# EAGLE schematic V-00880-00 (EAGLE 7.2.0)
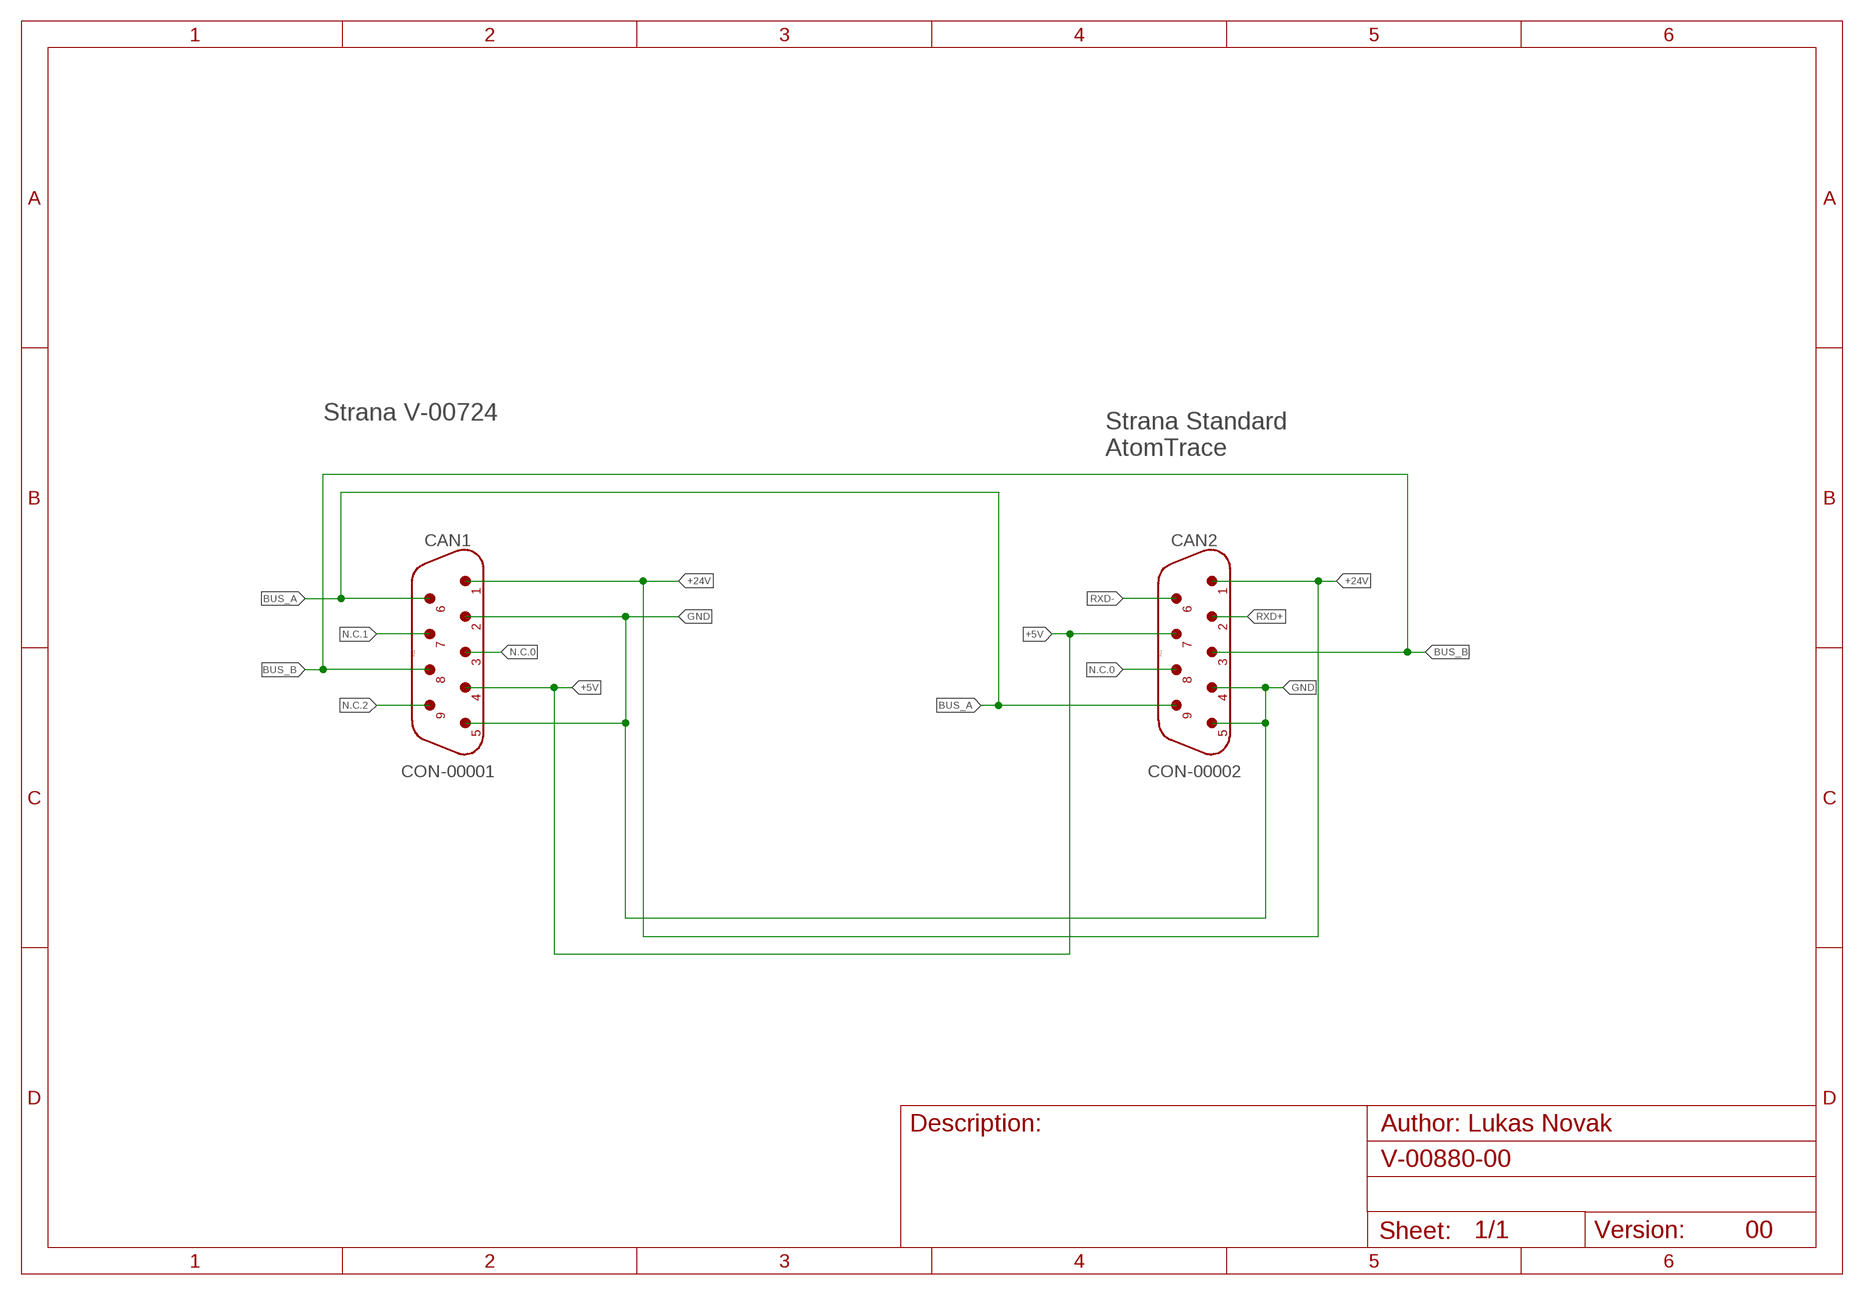
[diagram p0: schematic, sheet 1]

## Parts
CAN1  CON-00001  CAN_9V_/0  [CAN9V]
CAN2  CON-00002  CAN_9V_/0  [CAN9V]

## Nets
+5V: CAN1.4 CAN2.7
+24V: CAN1.1 CAN2.1
BUS_A: CAN1.6 CAN2.9
BUS_B: CAN1.8 CAN2.3
GND: CAN1.2 CAN1.5 CAN2.4 CAN2.5
N.C.0: CAN1.3 CAN2.8
N.C.1: CAN1.7
N.C.2: CAN1.9
RXD+: CAN2.2
RXD-: CAN2.6

## Notes on the sheet
- Strana V-00724
- Strana Standard
  AtomTrace
- 00

## Library data of the parts
CAN1 CAN2 = #PaJa_konektory:CAN_9V: Konektory CANNON - vidlice - 9pinu